# EAGLE design CompactSensorESP32 (EAGLE 9.7.0)
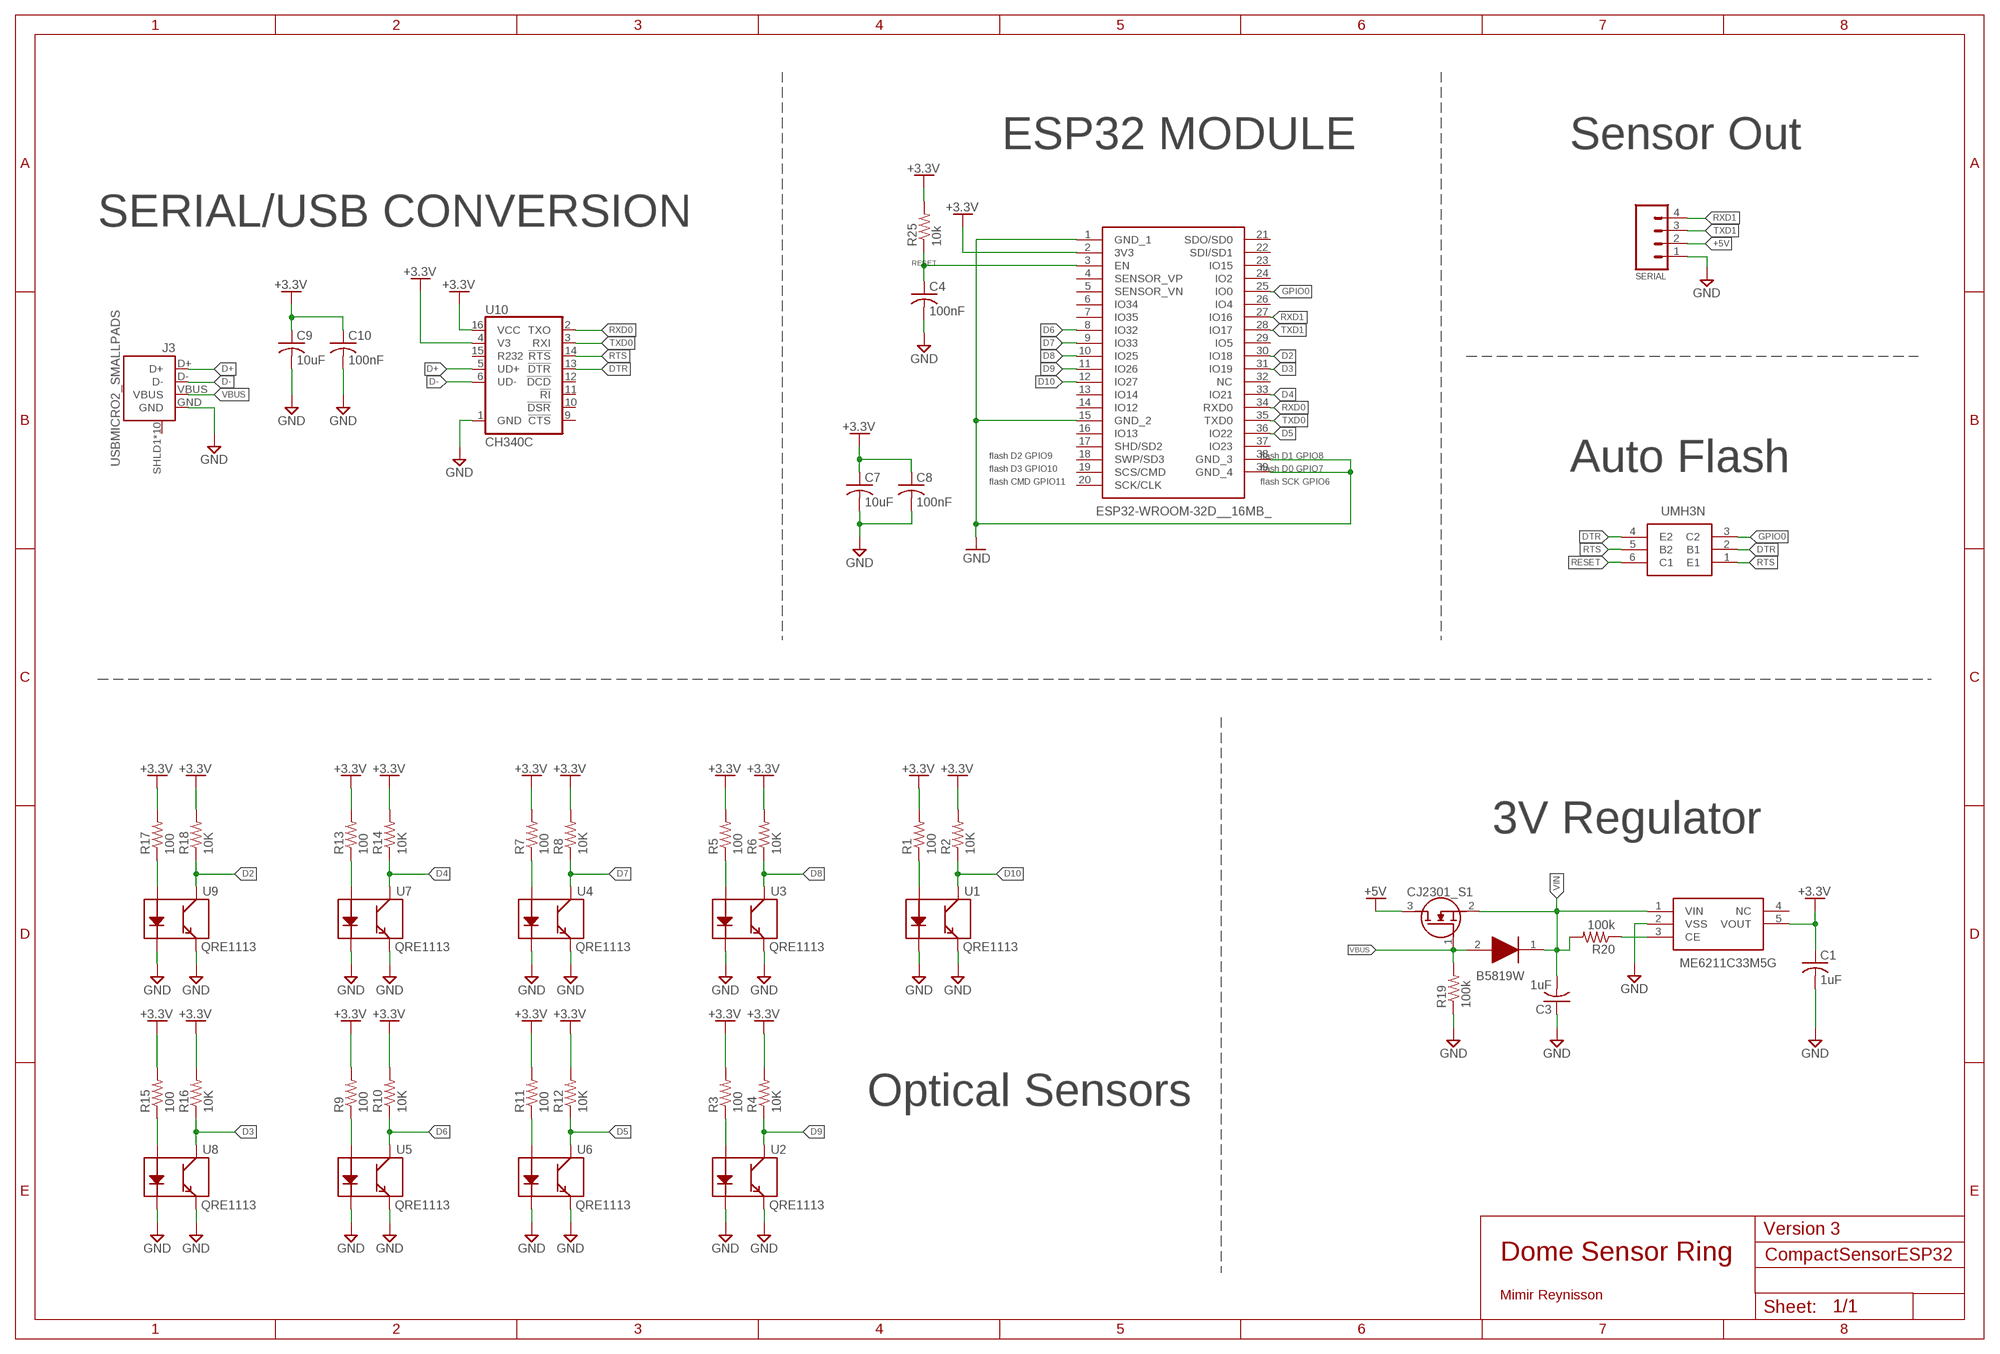
[diagram p0: schematic, sheet 1]

## Parts
C1  1uF  CAPACITOR-SMD-0402  [SMD-0402]
C3  1uF  CAPACITOR-SMD-0402  [SMD-0402]
C4  100nF  CAPACITOR-SMD-0402  [SMD-0402]
C7  10uF  CAPACITOR-SMD-0402  [SMD-0402]
C8  100nF  CAPACITOR-SMD-0402  [SMD-0402]
C9  10uF  CAPACITOR-SMD-0402  [SMD-0402]
C10  100nF  CAPACITOR-SMD-0402  [SMD-0402]
D1  B5819W  [SOD3716X125N]
IC1  ESP32-WROOM-32D__16MB_  [ESP32WROOM32D16MB]
IC2  ME6211C33M5G  [SOT95P282X145-5N]
J3  USBMICRO2_SMALLPADS  [USB-MICROB-10118194_SMALLPADS]
Q1  UMH3N  [SOT65P230X110-6N]
Q2  CJ2301_S1  [SOT95P240X115-3N]
R1  100  RESISTOR0402-RES  [0402-RES]
R2  10K  RESISTOR0402-RES  [0402-RES]
R3  100  RESISTOR0402-RES  [0402-RES]
R4  10K  RESISTOR0402-RES  [0402-RES]
R5  100  RESISTOR0402-RES  [0402-RES]
R6  10K  RESISTOR0402-RES  [0402-RES]
R7  100  RESISTOR0402-RES  [0402-RES]
R8  10K  RESISTOR0402-RES  [0402-RES]
R9  100  RESISTOR0402-RES  [0402-RES]
R10  10K  RESISTOR0402-RES  [0402-RES]
R11  100  RESISTOR0402-RES  [0402-RES]
R12  10K  RESISTOR0402-RES  [0402-RES]
R13  100  RESISTOR0402-RES  [0402-RES]
R14  10K  RESISTOR0402-RES  [0402-RES]
R15  100  RESISTOR0402-RES  [0402-RES]
R16  10K  RESISTOR0402-RES  [0402-RES]
R17  100  RESISTOR0402-RES  [0402-RES]
R18  10K  RESISTOR0402-RES  [0402-RES]
R19  100k  RESISTOR-SMD-0402  [SMD-0402]
R20  100k  RESISTOR-SMD-0402  [SMD-0402]
R25  10k  RESISTOR-SMD-0402  [SMD-0402]
SERIAL  CONN_04POLAR  [MOLEX-1X4]
U1  QRE1113  [QRE1113]
U2  QRE1113  [QRE1113]
U3  QRE1113  [QRE1113]
U4  QRE1113  [QRE1113]
U5  QRE1113  [QRE1113]
U6  QRE1113  [QRE1113]
U7  QRE1113  [QRE1113]
U8  QRE1113  [QRE1113]
U9  QRE1113  [QRE1113]
U10  CH340C  [SO016]

## Nets
+3.3V [power]: C1.1 C7.1 C8.1 C9.1 C10.1 IC1.2(3V3) IC2.5(VOUT) R1.2 R2.2 R3.2 R4.2 R5.2 R6.2 R7.2 R8.2 R9.2 R10.2 R11.2 R12.2 R13.2 R14.2 R15.2 R16.2 R17.2 R18.2 R25.2 U10.4(V3) U10.16(VCC)
+5V [power]: Q2.3(D) SERIAL.2
D2: IC1.30(IO18) R18.1 U9.3(C)
D3: IC1.31(IO19) R16.1 U8.3(C)
D4: IC1.33(IO21) R14.1 U7.3(C)
D5: IC1.36(IO22) R12.1 U6.3(C)
D6: IC1.8(IO32) R10.1 U5.3(C)
D7: IC1.9(IO33) R8.1 U4.3(C)
D8: IC1.10(IO25) R6.1 U3.3(C)
D9: IC1.11(IO26) R4.1 U2.3(C)
D10: IC1.12(IO27) R2.1 U1.3(C)
D+: J3.D+ U10.5(UD+)
D-: J3.D- U10.6(UD-)
DTR: Q1.2(B1) Q1.4(E2) U10.13(!DTR)
GND [power]: C1.2 C3.1 C4.2 C7.2 C8.2 C9.2 C10.2 IC1.1(GND_1) IC1.15(GND_2) IC1.38(GND_3) IC1.39(GND_4) IC2.2(VSS) J3.GND R19.1 SERIAL.1 U1.2(K) U1.4(E) U2.2(K) U2.4(E) U3.2(K) U3.4(E) U4.2(K) U4.4(E) U5.2(K) U5.4(E) U6.2(K) U6.4(E) U7.2(K) U7.4(E) U8.2(K) U8.4(E) U9.2(K) U9.4(E) U10.1(GND)
GPIO0: IC1.25(IO0) Q1.3(C2)
N$1: R1.1 U1.1(A)
N$2: R3.1 U2.1(A)
N$3: R5.1 U3.1(A)
N$4: R7.1 U4.1(A)
N$5: R9.1 U5.1(A)
N$6: R11.1 U6.1(A)
N$7: R13.1 U7.1(A)
N$8: R15.1 U8.1(A)
N$9: R17.1 U9.1(A)
N$10: IC2.3(CE) R20.1
RESET: C4.1 IC1.3(EN) Q1.6(C1) R25.1
RTS: Q1.1(E1) Q1.5(B2) U10.14(!RTS)
RXD0: IC1.34(RXD0) U10.2(TXO)
RXD1: IC1.27(IO16) SERIAL.4
TXD0: IC1.35(TXD0) U10.3(RXI)
TXD1: IC1.28(IO17) SERIAL.3
VBUS: D1.2(A) J3.VBUS Q2.1(G) R19.2
VIN: C3.2 D1.1(K) IC2.1(VIN) Q2.2(S) R20.2
Unconnected: IC1.4(SENSOR_VP) IC1.5(SENSOR_VN) IC1.6(IO34) IC1.7(IO35) IC1.13(IO14) IC1.14(IO12) IC1.16(IO13) IC1.17(SHD/SD2) IC1.18(SWP/SD3) IC1.19(SCS/CMD) IC1.20(SCK/CLK) IC1.21(SDO/SD0) IC1.22(SDI/SD1) IC1.23(IO15) IC1.24(IO2) IC1.26(IO4) IC1.29(IO5) IC1.32(NC) IC1.37(IO23) IC2.4(NC) J3.SHLD1(SHIELD) J3.SHLD2(SHIELD) J3.SHLD3(SHIELD) J3.SHLD4(SHIELD) J3.SHLD5(SHIELD) J3.SHLD6(SHIELD) J3.SHLD7(SHIELD) J3.SHLD8(SHIELD) J3.SHLD9(SHIELD) J3.SHLD10(SHIELD) U10.9(!CTS) U10.10(!DSR) U10.11(!RI) U10.12(!DCD) U10.15(R232)

## Notes on the sheet
- ESP32 MODULE | Sensor Out
- SERIAL/USB CONVERSION
- flash D2 GPIO9 | flash D1 GPIO8
- flash D3 GPIO10 | flash D0 GPIO7 | Auto Flash
- flash CMD GPIO11 | flash SCK GPIO6
- 3V Regulator
- Optical Sensors
- Version 3
- Dome Sensor Ring
- Mimir Reynisson

## Library data of the parts
C1 C3 C4 C7-C10 = Fuzzy:CAPACITOR-SMD-0402
D1 = B5819W:B5819W: 40V 1A 600mV @ 1A SOD-123 Schottky Barrier Diodes (SBD) Source: Datasheet <https://datasheet.lcsc.com/szlcsc/Changjiang-Electronics-Tech-CJ-B5819W_C8598.pdf>; DESCRIPTION: 40V 1A 600mV @ 1A SOD-123 Schottky Barrier Diodes (SBD); HEIGHT: 1.25mm; MANUFACTURER_NAME: Changjiang Electronics Tech (CJ); MANUFACTURER_PART_NUMBER: B5819W
IC1 = ESP32-WROOM-32D__16MB_:ESP32-WROOM-32D__16MB_: WiFi Modules (802.11) SMD Module, ESP32-D0WD, 128Mbits SPI flash, UART mode, PCB antenna Source: Datasheet <https://www.espressif.com/sites/default/files/documentation/esp32-wroom-32d_esp32-wroom-32u_datasheet_en.pdf>; DESCRIPTION: WiFi Modules (802.11) SMD Module, ESP32-D0WD, 128Mbits SPI flash, UART mode, PCB antenna; HEIGHT: 3.2mm; MANUFACTURER_NAME: Espressif Systems; MANUFACTURER_PART_NUMBER: ESP32-WROOM-32D (16MB); MOUSER_PART_NUMBER: 356-ES32WROOM32D16MB
IC2 = ME6211C33M5G:ME6211C33M5G: High Speed LDO Regulators, High PSRR, Low noise, ME6211 Series Source: Datasheet; DESCRIPTION: High Speed LDO Regulators, High PSRR, Low noise, ME6211 Series; HEIGHT: 1.45mm; MANUFACTURER_NAME: Microne; MANUFACTURER_PART_NUMBER: ME6211C33M5G
J3 = rseries:USB: USB Connectors
Q1 = UMH3N:UMH3N: 2 NPN pre-biased (Dual) 100mA 50V SC-70-6(SOT-363) Digital Transistors RoHS Source: Datasheet <https://datasheet.lcsc.com/szlcsc/Changjiang-Electronics-Tech-CJ-UMH3N_C62892.pdf>; DESCRIPTION: 2 NPN pre-biased (Dual) 100mA 50V SC-70-6(SOT-363) Digital Transistors RoHS; HEIGHT: 1.1mm; MANUFACTURER_NAME: Changjiang Electronics Tech (CJ); MANUFACTURER_PART_NUMBER: UMH3N
Q2 = CJ2301_S1:CJ2301_S1: MOSFET P Trench 20V 2.3A 1V @ 250uA 112 m @ 2.8A,4.5V SOT-23(SOT-23-3) RoHS Source: Datasheet <https://datasheet.lcsc.com/szlcsc/Changjiang-Electronics-Tech-CJ-CJ2301-S1_C8547.pdf>; DESCRIPTION: MOSFET P Trench 20V 2.3A 1V @ 250uA 112 m @ 2.8A,4.5V SOT-23(SOT-23-3) RoHS; HEIGHT: 1.15mm; MANUFACTURER_NAME: Changjiang Electronics Tech (CJ); MANUFACTURER_PART_NUMBER: CJ2301 S1
R1-R18 = SparkFun:RESISTOR: Resistor Basic schematic elements and footprints for 0603, 1206, and PTH resistors.
R19 R20 R25 = Fuzzy:RESISTOR-SMD-0402
SERIAL = SparkFun-Connectors:CONN_04: Multi connection point. Often used as Generic Header-pin footprint for 0.1 inch spaced/style header connections On any of the 0.1 inch spaced packages, you can populate with these: Break Away Headers - Straight <https://www.sparkfun.com/products/116> (PRT-00116) Break Away Male Headers - Right Angle <https://www.sparkfun.com/products/553> (PRT-00553) Female Headers <https://www.sparkfun.com/products/115> (PRT-00115) Break Away Headers - Machine Pin <https://www.sparkfun.com/products/117> (PRT-00117) Break Away Female Headers - Swiss Machine Pin <https://www.sparkfun.com/products/743> (PRT-00743) For SCREWTERMINALS and SPRING TERMINALS visit here: Screw Terimnals on SparkFun.com <https://www.sparkfun.com/search/results?term=Screw+Terminals> (5mm/3.5mm/2.54mm spacing) This device is also useful as a general connection point to wire up your design to another part of your project. Our various solder wires solder well into these plated through hole pads. Hook-Up Wire - Assortment (Stranded, 22 AWG) <https://www.sparkfun.com/products/11375> (PRT-11375) Hook-Up Wire - Assortment (Solid Core, 22 AWG) <https://www.sparkfun.com/products/11367> (PRT-11367) View the entire wire category on our website here <https://www.sparkfun.com/categories/141> Special notes: Molex polarized connector foot print use with SKU : PRT-08231 with associated crimp pins and housings. 1MM SMD Version SKU: PRT-10208; PROD_ID: CONN-08186; SF_ID: PRT-08231
U1-U9 = SparkFun:QRE1113
U10 = SparkFun-IC-Comms:CH340C; PROD_ID: IC-14038

## Net classes
0 default: width 0.254 mm
1 power: width 0.508 mm
2 motor: width 1.27 mm

## Board
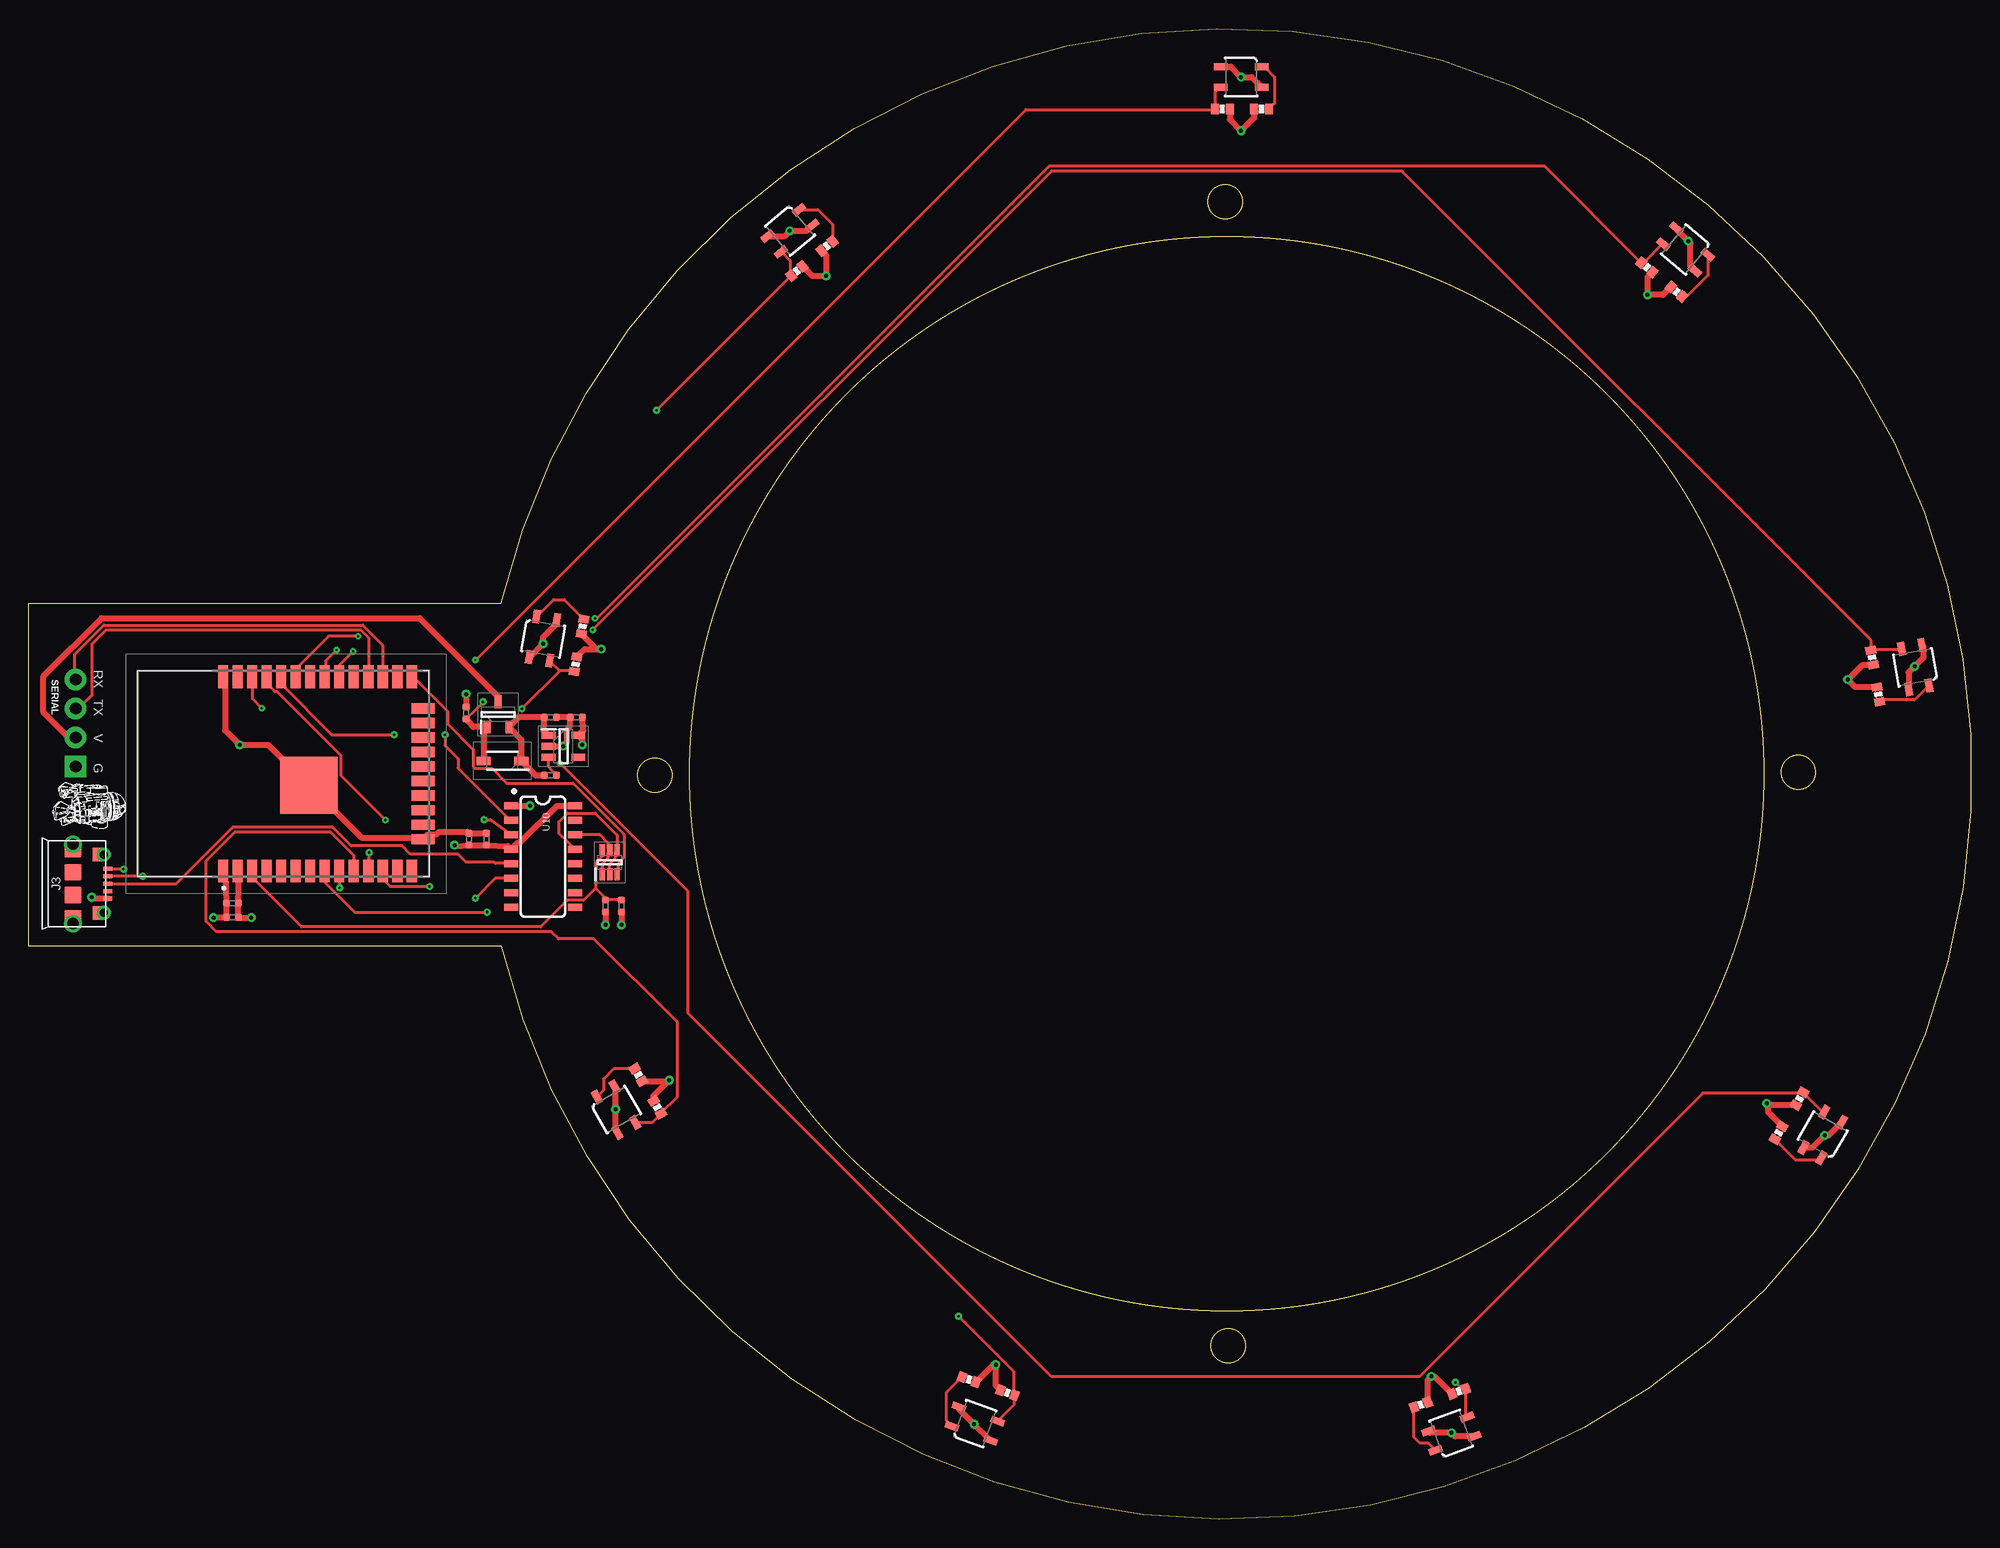
[diagram p1: board, top side]
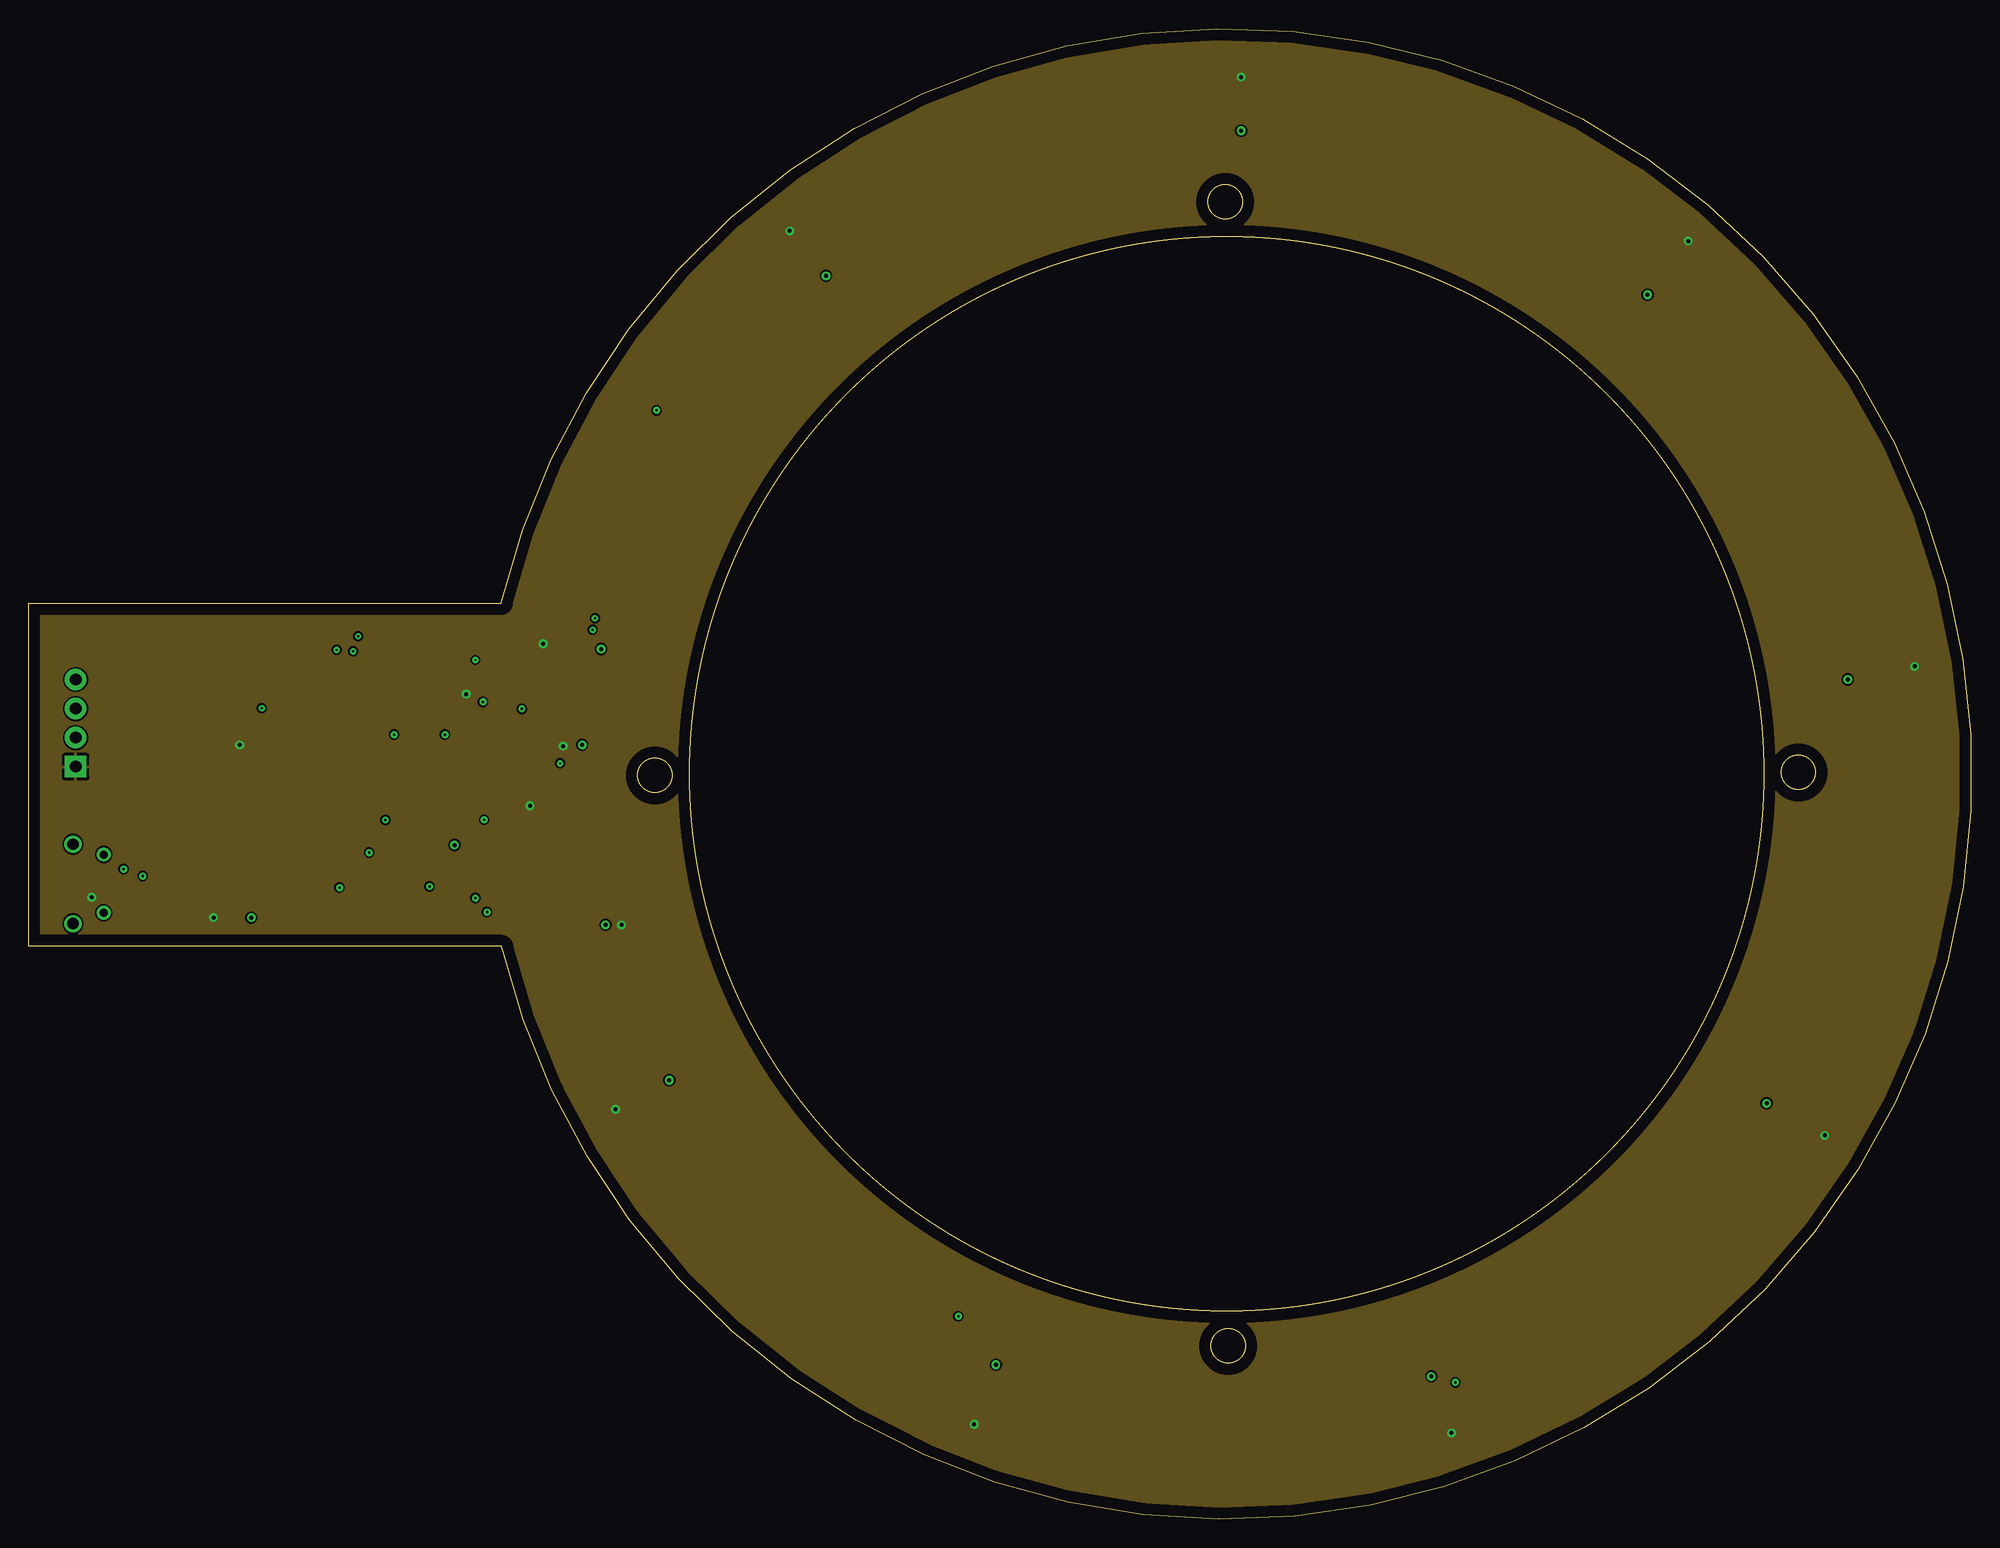
[diagram p2: board, inner layer GND]
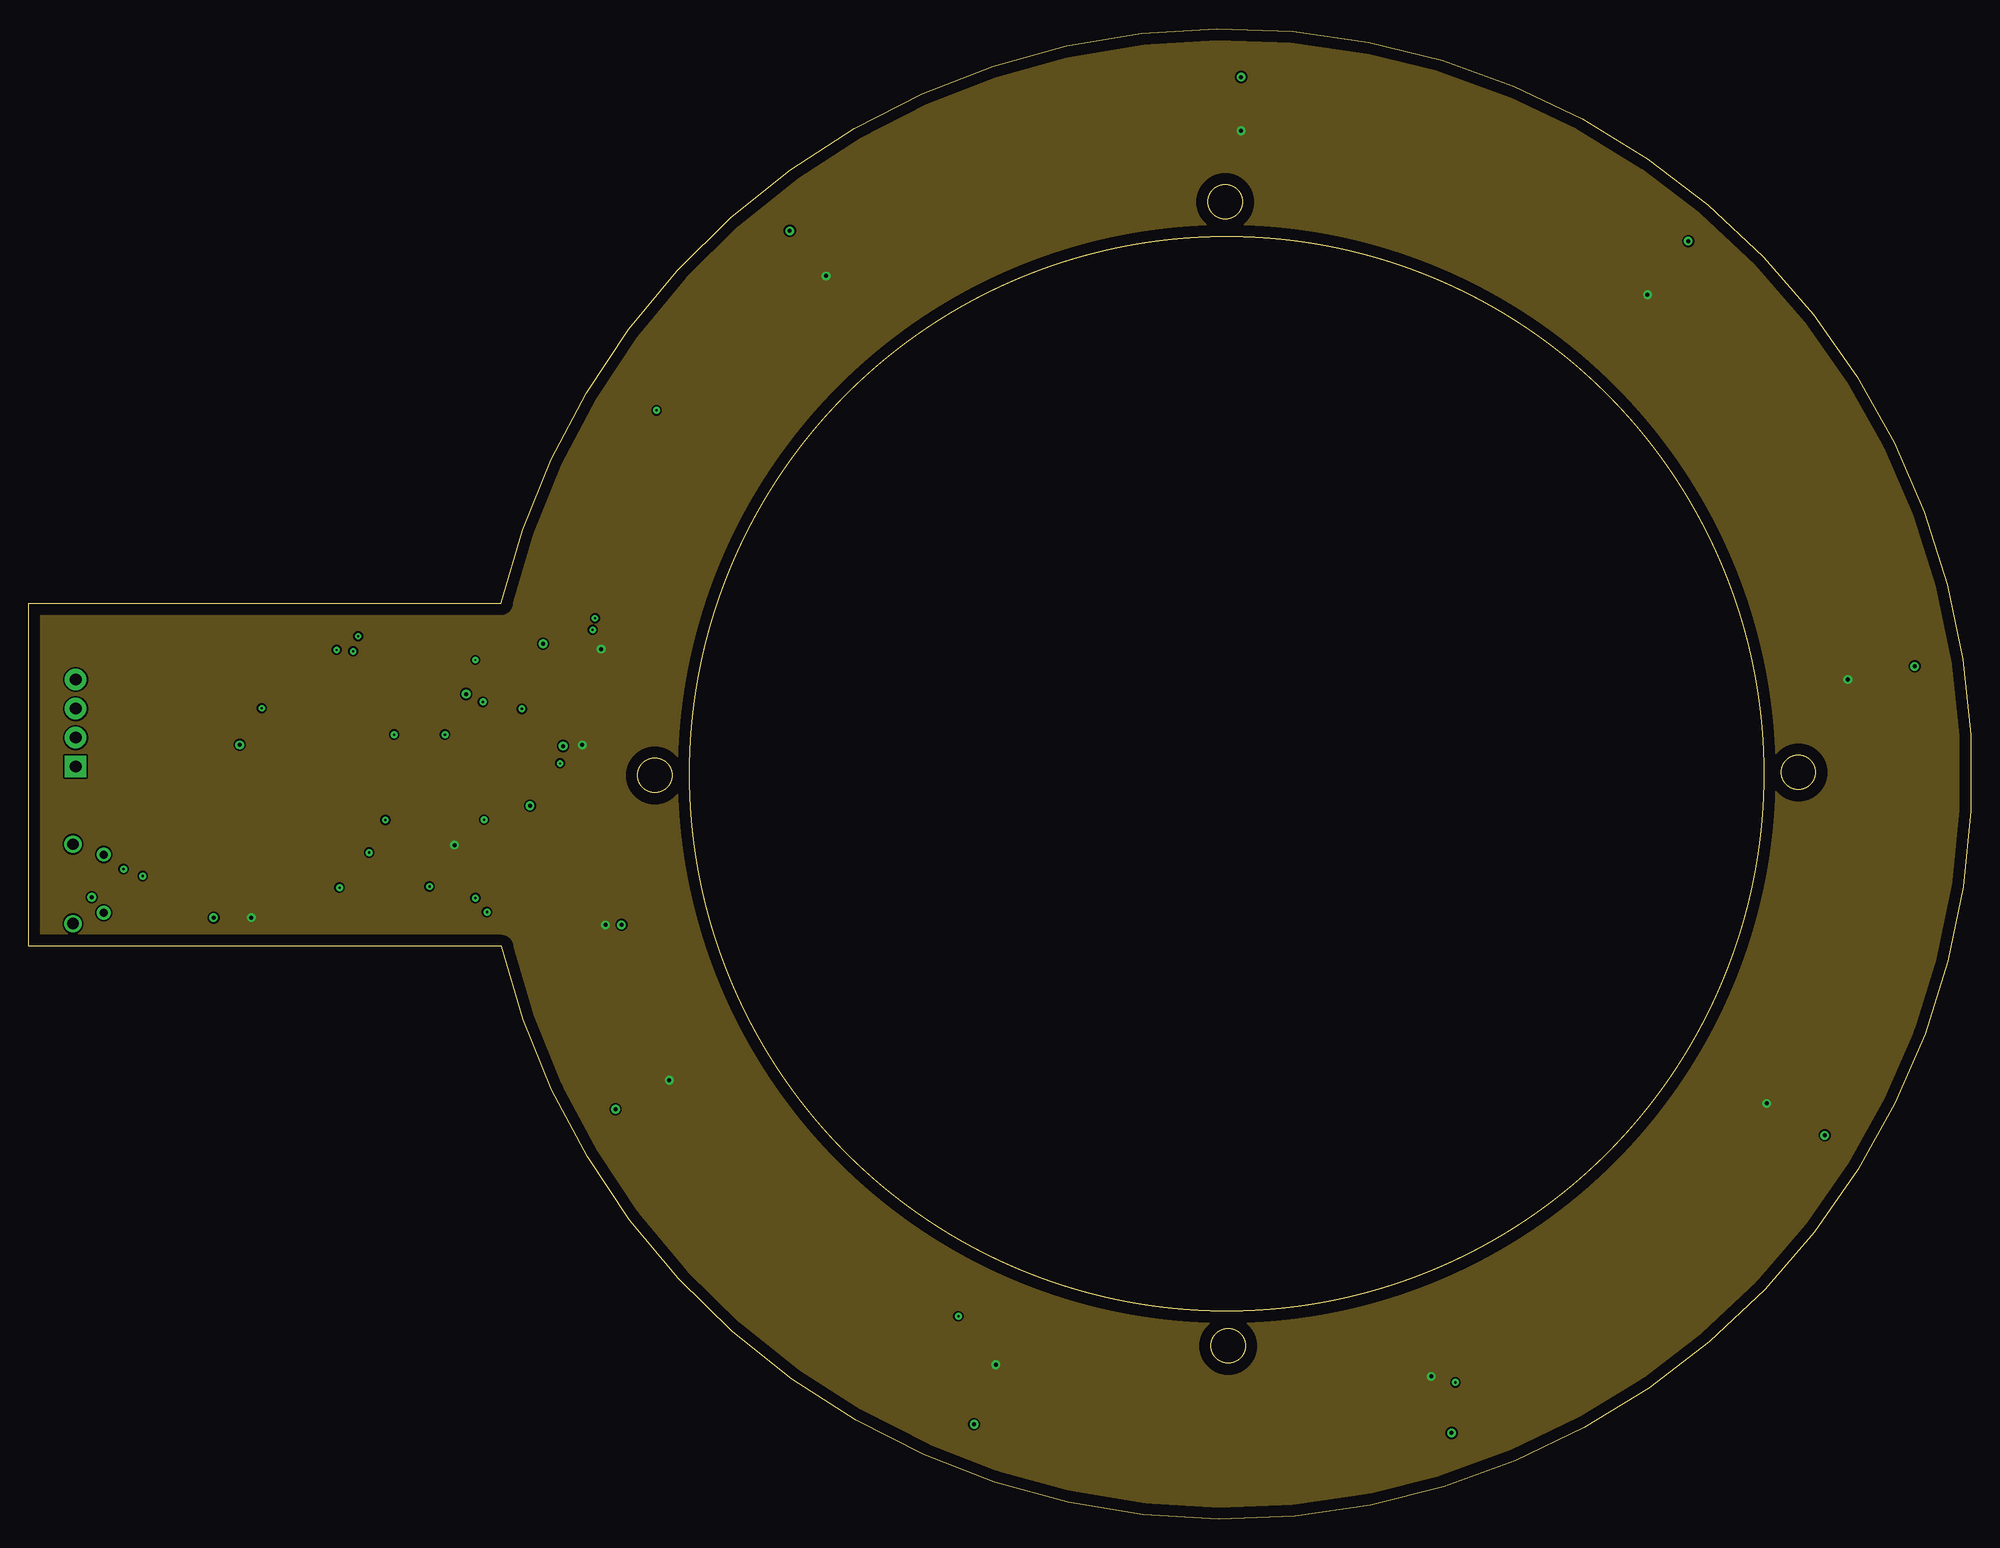
[diagram p3: board, inner layer PWR]
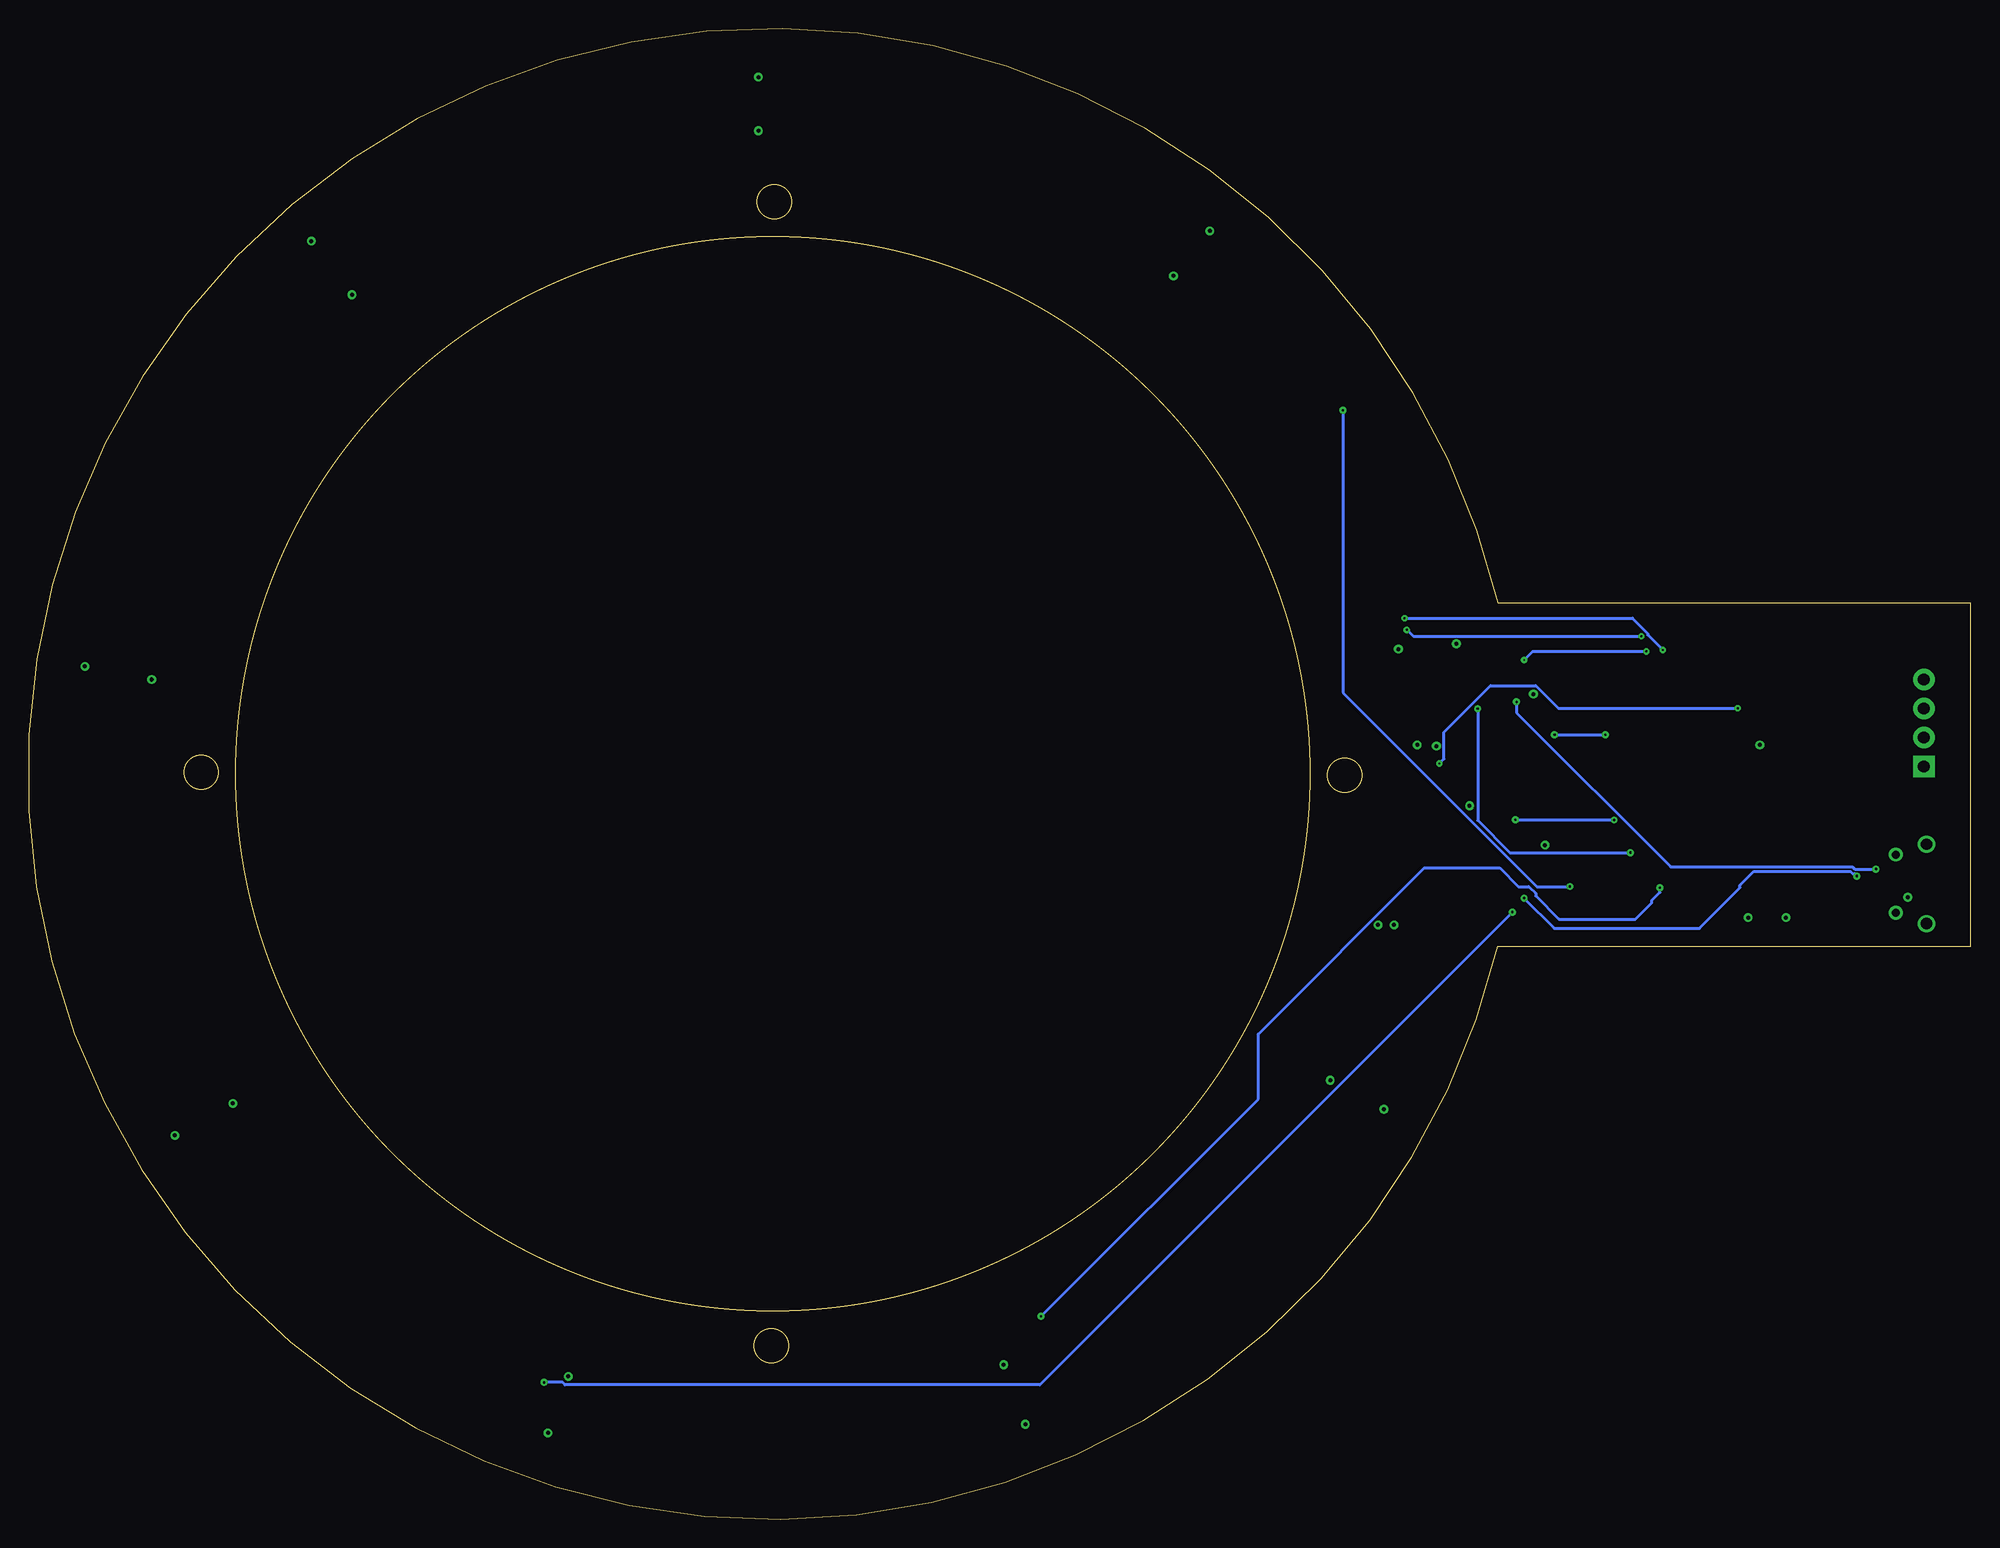
[diagram p4: board, bottom side, seen from below]

Size 169.96 x 130.4 mm. Coordinates in mm from the lower left corner, seen from the top.
Outline: 41.4,50.12 0,50.12 0,80.12 41.36,80.12 arc-333 41.4,50.12
Outline: circle at 104.83,65.2 radius 46.99
Outline: circle at 154.87,65.33 radius 1.5
Outline: circle at 104.7,115.23 radius 1.5
Outline: circle at 104.97,15.17 radius 1.5
Outline: circle at 54.8,65.07 radius 1.5
Copper layers (1+2*15+16): Top 0.035mm / dielectric 1.5mm / GND 0.035mm / dielectric 0.15mm / PWR 0.035mm / dielectric 0.2mm / Bottom 0.035mm
Design rules "default *": minimum track width 6mil, minimum drill 0.15mm, track to track 6mil, track to pad 6mil, pad to pad 6mil, via to via 6mil, smd to smd 6mil, copper to edge 40mil, drill to drill 6mil, minimum pad ring 10mil, minimum via ring 8mil, stop-mask expansion 4mil, vias tented up to drill 0mil, thermal gap 10mil

### Footprints (pad centres in the part's own frame; a part is rotated, then mirrored left to right if it is on the bottom)
SMD-0402 = smd 0.635 x 0.635: 1 -0.519,0; 2 0.519,0
SOD3716X125N = smd 1.25 x 0.75: 1 -1.65,0; 2 1.65,0
ESP32WROOM32D16MB = smd 2 x 0.9: 1 -8.5,5.26; 2 -8.5,3.99; 3 -8.5,2.72; 4 -8.5,1.45; 5 -8.5,0.18; 6 -8.5,-1.09; 7 -8.5,-2.36; 8 -8.5,-3.63; 9 -8.5,-4.9; 10 -8.5,-6.17; 11 -8.5,-7.44; 12 -8.5,-8.71; 13 -8.5,-9.98; 14 -8.5,-11.25; 25 8.5,-11.25; 26 8.5,-9.98; 27 8.5,-8.71; 28 8.5,-7.44; 29 8.5,-6.17; 30 8.5,-4.9; 31 8.5,-3.63; 32 8.5,-2.36; 33 8.5,-1.09; 34 8.5,0.18; 35 8.5,1.45; 36 8.5,2.72; 37 8.5,3.99; 38 8.5,5.26 | smd 0.9 x 2: 15 -5.715,-12.25; 16 -4.445,-12.25; 17 -3.175,-12.25; 18 -1.905,-12.25; 19 -0.635,-12.25; 20 0.635,-12.25; 21 1.905,-12.25; 22 3.175,-12.25; 23 4.445,-12.25; 24 5.715,-12.25 | smd 5 x 5: 39 -1,-2.24
SOT95P282X145-5N = smd 1.2 x 0.6: 1 -1.3,0.95; 2 -1.3,0; 3 -1.3,-0.95; 4 1.3,-0.95; 5 1.3,0.95
USB-MICROB-10118194_SMALLPADS = smd 0.8 x 0.3: D+ -2.9,0; D- -2.9,-0.65; GND -2.9,1.3; ID -2.9,0.65; VBUS -2.9,-1.3 | drill 0.7: SHLD1 -2.55,2.55; SHLD2 -2.55,-2.55 | drill 1: SHLD3 0.15,3.5; SHLD4 0.15,-3.45 | smd 1.5 x 1.1: SHLD5 0.15,2.85; SHLD6 0.15,-2.85 | smd 1.5 x 1.5: SHLD7 0.15,1; SHLD8 0.15,-1 | smd 1 x 1.2: SHLD9 -2.05,-2.55; SHLD10 -2.05,2.55
SOT65P230X110-6N = smd 1.05 x 0.45: 1 -1.05,0.65; 2 -1.05,0; 3 -1.05,-0.65; 4 1.05,-0.65; 5 1.05,0; 6 1.05,0.65
SOT95P240X115-3N = smd 1.1 x 0.6: 1 -1.1,0.95; 2 -1.1,-0.95; 3 1.1,0
0402-RES = smd 0.7 x 0.9: 1 -0.65,0; 2 0.65,0
MOLEX-1X4 = drill 1.016 pad 1.88 square: 1 0,0 | drill 1.016 pad 1.88: 2 2.54,0; 3 5.08,0; 4 7.62,0
QRE1113 = smd 1.2 x 0.6: 1 -1.8,-0.9; 2 1.8,-0.9; 3 1.8,0.9; 4 -1.8,0.9
SO016 = smd 0.6 x 1.2: 1 -4.445,-2.8; 2 -3.175,-2.8; 3 -1.905,-2.8; 4 -0.635,-2.8; 5 0.635,-2.8; 6 1.905,-2.8; 7 3.175,-2.8; 8 4.445,-2.8; 9 4.445,2.8; 10 3.175,2.8; 11 1.905,2.8; 12 0.635,2.8; 13 -0.635,2.8; 14 -1.905,2.8; 15 -3.175,2.8; 16 -4.445,2.8

### Placement (x,y rotation side)
C1  47.94,70.15 180 top
C3  45.65,70.15 180 top
C4  51.88,53.64 270 top
C7  17.84,53.9 180 top
C8  17.84,52.65 180 top
C9  40.06,59.48 90 top
C10  38.54,59.48 90 top
D1  41.46,66.34 180 top
IC1  22.28,65.2 90 top
IC2  46.8,67.61 0 top
J3  4.03,55.59 180 top
Q1  50.86,57.45 90 top
Q2  41.08,70.41 90 top
R1  69.86,111.38 220 top
R2  67.23,109.2 40 top
R3  48.47,78.09 260 top
R4  47.86,74.8 80 top
R5  53.36,38.87 300 top
R6  55.01,36.03 120 top
R7  82.29,12.22 340 top
R8  85.64,11.06 160 top
R9  121.81,10.01 20 top
R10  125.15,11.19 200 top
R11  153.14,33.79 60 top
R12  154.96,36.79 240 top
R13  161.84,72.15 100 top
R14  161.31,75.38 280 top
R15  144.2,107.38 140 top
R16  141.61,109.51 320 top
R17  107.88,123.37 180 top
R18  104.45,123.37 0 top
R19  38.29,70.53 270 top
R20  45.65,65.07 180 top
R25  50.48,53.64 270 top
SERIAL  4.12,65.83 90 top
U1  66.62,112.71 220 top
U2  45.02,77.04 260 top
U3  51.41,35.82 300 top
U4  82.79,8.35 340 top
U5  124.49,7.48 20 top
U6  156.99,33.62 60 top
U7  165.09,74.53 100 top
U8  144.99,111.08 140 top
U9  106.1,126.16 180 top
U10  45.02,57.96 270 top

### Tracks (layer width: path | path; a pad name or v marks a point on that pad's centre or on a via)
+3.3V  (via drill 0.35)
  Top 0.508: R15.2 143.02,107.11 v141.66,107.11 141.66,108.65 R16.2 | R13.2 159.85,72.79 v159.19,73.45 160.48,74.74 R14.2 | R12.2 152.22,36.23 | 152.22,36.23 v152.08,36.37 | R11.2 152.22,35.6 152.22,36.23 | R10.2 123.01,12.49 v122.74,12.49 122.42,12.18 R9.2 | R8.2 84.64,11.67 v84.64,13.51 84.42,13.51 R7.2 | R6.2 54.68,37.02 v56.07,38.4 55.97,38.3 R5.2 | R4.2 48.66,76.12 v50.1,76.12 49.69,76.12 R3.2 | R1.2 69.78,110.53 v69.78,108.76 68.58,108.76 R2.2 | R18.2 105.1,122.46 v106.1,121.46 107.23,122.59 R17.2 | v48.45,67.74 48.45,68.21 IC2.5 48.54,69.01 C1.1 | v48.45,67.74 v48.45,67.73 | R25.2 v50.48,51.99 | U10.16 46.23,62.41 42.99,59.16 42.78,59.16 U10.4 41.93,58.88 C9.1 C10.1 37.36,58.88 v37.27,58.97 | 48.57,67.74 v48.45,67.74 | v19.49,52.63 18.46,52.63 C8.1 C7.1 18.44,56.55 18.37,56.77 IC1.2
  pour PWR: -10.75,-26.16 198.63,-26.16 196.21,-23.74 196.2,-23.72 196.2,156.56 -13.2,156.56 -11.93,-27.33 -10.78,-26.18
+5V
  Top 0.508: Q2.3 41.13,71.6 41.13,71.91 34.22,78.81 6.38,78.81 1.3,73.73 1.3,70.58 3.44,68.45 4.05,68.45 SERIAL.2
D2  (via drill 0.15)
  Top 0.254: U9.3 104.22,125.25 103.82,124.84 103.82,123.42 R18.1 103.72,123.31 87.26,123.31 v39.1,75.16 | v28.41,75.92 27.21,74.72 27.21,73.73 IC1.30
  Bottom 0.254: v39.1,75.16 38.34,75.92 v28.41,75.92
D3  (via drill 0.15)
  Top 0.254: U8.3 142.93,111.53 141.41,110.01 141.21,110.01 R16.1 141,110.01 132.67,118.34 89.29,118.34 49.77,78.81 v49.56,78.81 | v26.96,76.05 25.99,75.08 25.99,73.73 IC1.31
  Bottom 0.254: v26.96,76.05 28.28,77.37 28.28,77.47 29.62,78.81 v49.56,78.81
D4  (via drill 0.15)
  Top 0.254: U7.3 163.86,76.07 161.22,76.07 R14.1 161.22,76.17 161.22,76.88 120.18,117.93 89.49,117.93 v49.36,77.8 | v28.84,77.24 26.25,77.24 23.45,74.45 23.45,73.73 IC1.33
  Bottom 0.254: v28.84,77.24 48.8,77.24 v49.36,77.8
D5  (via drill 0.15)
  Top 0.254: U6.3 157.06,35.53 155.33,37.26 R12.1 155.23,37.26 146.49,37.26 121.7,12.47 89.49,12.47 57.69,44.27 57.69,54.94 v46.52,66.11 | v20.4,70.94 19.59,71.75 19.59,73.63 IC1.36
  Bottom 0.254: v20.4,70.94 36.1,70.94 38.08,72.92 42.05,72.92 46.11,68.86 46.11,66.52 v46.52,66.11
D6  (via drill 0.2)
  Top 0.254: U5.3 125.87,9.01 125.76,9.12 125.76,11.35 R10.1 125.66,11.45 125.36,11.45 v124.85,11.96 | IC1.8 25.99,56.67 25.99,55.64 28.52,53.11 v40.12,53.11
  Bottom 0.254: v124.85,11.96 123.22,11.96 123.02,11.76 81.47,11.76 v40.12,53.11
D7  (via drill 0.2)
  Top 0.254: U4.3 86.25,10.04 R8.1 86.24,10.95 86.24,12.88 v81.36,17.75 | v27.21,55.24 27.21,56.77 IC1.9
  Bottom 0.254: v27.21,55.24 27.21,54.84 27.92,54.13 27.92,53.92 29.35,52.5 36.05,52.5 38.08,54.53 38.08,54.73 38.69,55.34 39.61,55.34 41.23,56.97 47.84,56.97 62.37,42.44 62.37,36.75 v81.36,17.75
D8
  Top 0.254: U3.3 54.58,34.71 R6.1 55.36,35.53 56.78,36.95 56.78,43.46 49.46,50.77 46.36,50.77 45.73,51.41 16.42,51.41 15.53,52.3 15.53,57.58 18.07,60.12 26.4,60.12 28.43,58.09 28.43,56.77 IC1.10
D9  (via drill 0.2)
  Top 0.254: 46.41,74.24 47.74,74.24 R4.1 | 46.41,74.24 45.6,75.05 U2.3 | v29.8,58.32 29.75,58.27 29.75,56.77 IC1.11 | v43.16,70.89 46.41,74.14 46.41,74.24
  Bottom 0.254: v29.8,58.32 40.34,58.32 43.16,61.14 v43.16,70.89
D10  (via drill 0.2)
  Top 0.254: U1.3 65.92,110.82 66.63,110.11 66.63,108.79 R2.1 66.63,108.68 v54.95,97 | v35.09,55.34 31.68,55.34 31.07,55.95 31.07,56.67 IC1.12
  Bottom 0.254: v35.09,55.34 37.98,55.34 54.95,72.31 v54.95,97
D+
  Top 0.254: J3.D+ 6.99,55.55 12.89,55.55 17.86,60.53 26.6,60.53 28.23,58.9 32.7,58.9 33.41,58.19 37.58,58.19 38.29,57.48 40.72,57.48 40.83,57.38 42.15,57.38 U10.5
D-  (via drill 0.2)
  Top 0.254: v9.99,56.26 6.99,56.26 J3.D- | v39.1,54.33 40.83,56.06 U10.6
  Bottom 0.254: v9.99,56.26 10.19,56.46 10.35,56.46 10.55,56.67 18.98,56.67 20.2,55.45 20.2,55.24 23.76,51.69 36.46,51.69 v39.1,54.33
DTR
  Top 0.254: Q1.2 50.86,57.36 51.36,57.86 51.36,58.36 Q1.4 51.51,59.85 49.59,61.77 47.16,61.77 46.41,61.03 46.41,59.97 47.1,59.29 47.13,59.29 U10.13
GND  (via drill 0.35)
  Top 0.508: U7.2 165.79,76.33 165.79,75.36 v165.03,74.6 164.52,74.08 U7.4 | U8.2 144.19,112.84 v145.22,111.81 145.43,111.6 145.43,109.6 U8.4 | U6.2 157.52,33.58 v157.16,33.58 156.09,32.51 U6.4 | U5.2 124.81,7.25 v124.52,7.54 122.61,7.54 122.51,7.69 U5.4 | U4.2 84.15,6.89 v82.74,8.3 81.41,9.63 U4.4 | U3.2 51.37,33.97 v51.37,35.86 51.37,37.75 U3.4 | U2.2 45.02,76.61 45.02,77.14 | 45.02,77.14 46.22,78.34 U2.4 | U1.2 66.16,112.25 v66.61,112.7 68.1,112.7 U1.4 | U9.2 105.2,127.06 v106.1,126.16 107,126.16 U9.4 | C3.1 C1.2 47.34,69.28 47.09,69.03 47.09,67.95 v46.77,67.64 45.52,67.64 IC2.2 | v38.29,72.18 R19.1 | C4.2 v51.88,51.99 | U10.1 v43.87,62.41 | C9.2 C10.2 38.39,60.12 35.92,60.12 35.7,59.9 34.95,59.9 IC1.15 | v16.19,52.63 16.21,52.65 C8.2 C7.2 17.24,56.48 17.15,56.67 17.05,56.67 IC1.1 | J3.GND 5.63,54.29 v5.52,54.4 | 34.63,59.51 IC1.15 | IC1.15 34.32,59.61 29.14,59.61 24.57,64.18 IC1.39 | 16.95,73.63 IC1.38 17.2,73.52 17.2,69.01 v18.47,67.74 20.98,67.74 IC1.39 | 24.27,64.18 IC1.39 | v45.02,76.58 45.02,77.14
  pour GND: -1.77,-13.46 184.77,-13.46 184.77,147.67 -1.77,147.67
GPIO0
  Top 0.254: Q1.3 51.6,56.46 51.6,57.38 52.1,57.88 52.1,59.92 47.63,64.39 41.84,64.39 40.54,65.69 39.07,65.69 38.91,65.85 38.91,67.32 36.66,69.57 36.66,70.69 33.61,73.73 IC1.25
N$1
  Top 0.254: U1.1 69.06,114.56 70.35,113.27 R1.1
N$2
  Top 0.254: U2.1 45.92,80.44 46.88,80.44 R3.1
N$3
  Top 0.254: U3.1 50.35,37.55 50.35,38.53 51.25,39.43 R5.1
N$4
  Top 0.254: U4.1 80.32,8.59 80.32,11.08 R7.1
N$5
  Top 0.254: U5.1 122.47,6.65 121.73,6.65 121.2,7.18 R9.1
N$6
  Top 0.254: U6.1 156.68,31.42 154.63,31.42 R11.1
N$7
  Top 0.254: U7.1 165.05,71.68 164.31,71.68 164.3,71.67 162.11,71.67 R13.1
N$8
  Top 0.254: U8.1 146.95,108.84 145.07,106.96 R15.1
N$9
  Top 0.254: U9.1 108.13,127.06 109.03,126.16 109.03,123.86 R17.1
N$10
  Top 0.254: R20.1 45.5,65.83 IC2.3
RESET
  Top 0.254: C4.1 51.8,54.23 50.48,54.23 R25.1 50.48,54.33 49.67,55.14 | 49.67,55.14 49.67,57.48 50.17,57.99 50.17,58.49 Q1.6 | IC1.3 19.59,56.67 19.59,56.1 23.88,51.81 44.81,51.81 47.13,54.13 48.55,54.13 49.56,55.14 49.67,55.14
RTS
  Top 0.254: Q1.1 50.21,57.36 50.71,57.86 50.71,58.36 Q1.5 50.71,58.65 50.71,59.14 49.99,59.87 U10.14
RXD0  (via drill 0.2)
  Top 0.254: v36.43,68.63 36.43,67.66 37.58,66.52 37.58,65.71 42.15,61.14 U10.2 | v31.99,68.63 26.53,68.63 22.13,73.02 22.13,73.63 IC1.34
  Bottom 0.254: v36.43,68.63 v31.99,68.63
RXD1
  Top 0.254: IC1.27 30.97,73.73 30.97,76.47 29.24,78.2 6.59,78.2 4.05,75.66 4.05,73.53 SERIAL.4
TXD0  (via drill 0.2)
  Top 0.254: v39.86,61.19 40.39,61.19 U10.3 | v31.23,61.16 27.31,65.07 27.31,66.83 21.73,72.41 21.52,72.41 20.91,73.02 20.91,73.63 IC1.35
  Bottom 0.254: v39.86,61.19 31.25,61.19 v31.23,61.16
TXD1
  Top 0.254: IC1.28 29.75,73.73 29.75,77.11 29.07,77.8 6.79,77.8 5.57,76.58 5.57,72.11 4.45,70.99 4.15,70.99 SERIAL.3
VBUS  (via drill 0.2)
  Top 0.254: v8.31,56.87 6.99,56.87 J3.VBUS | R19.2 39.76,71.41 v39.76,71.5
  Top 0.508: D1.2 39.81,68.99 Q2.1 38.91,69.31 R19.2
  Bottom 0.254: v8.31,56.87 10.14,56.87 10.35,57.07 26.27,57.07 39.76,70.56 v39.76,71.5
VIN
  Top 0.508: IC2.1 45.05,69.01 C3.2 42.88,70.15 Q2.2 43.11,68.23 D1.1 44.38,65.07 R20.2

### Text on the board
tNames: RX | TX | V | G